# Altium project Common_HVSUP_ISOL_6W.PrjPCB (part 2 of 5)

## Sheet HV_PWR_STAGE_6W.SchDoc: HV_Module
size 420 x 297 mm; EDA_Number: ARTIQ; Projet: HV_Module; Author: G.Kasprowicz; CompanyName: WUT ISE; DrawnBy: G.Kasprowicz; Organization: WUT ISE; Address1: PW ISE; Address2: Nowowiejska 15/19 00-665 Warsaw; Address3: gkasprow@gmail.com; DocumentNumber: 3; Revision: 1.0; SheetNumber: 3; SheetTotal: 6; ModifiedBy: -; CheckedDate: -; Title2: HV_PWR_Stage; DivGrp: WUT ISE; Designer: G.Kasprowicz; ModifiedDate: -; ProjectName: Sensor Box
Used 2 times, as channels U_HV_Module/U_HV_PWR_STAGE1, U_HV_Module/U_HV_PWR_STAGE2. Parts and nets are listed once, with the designators drawn on the sheet.
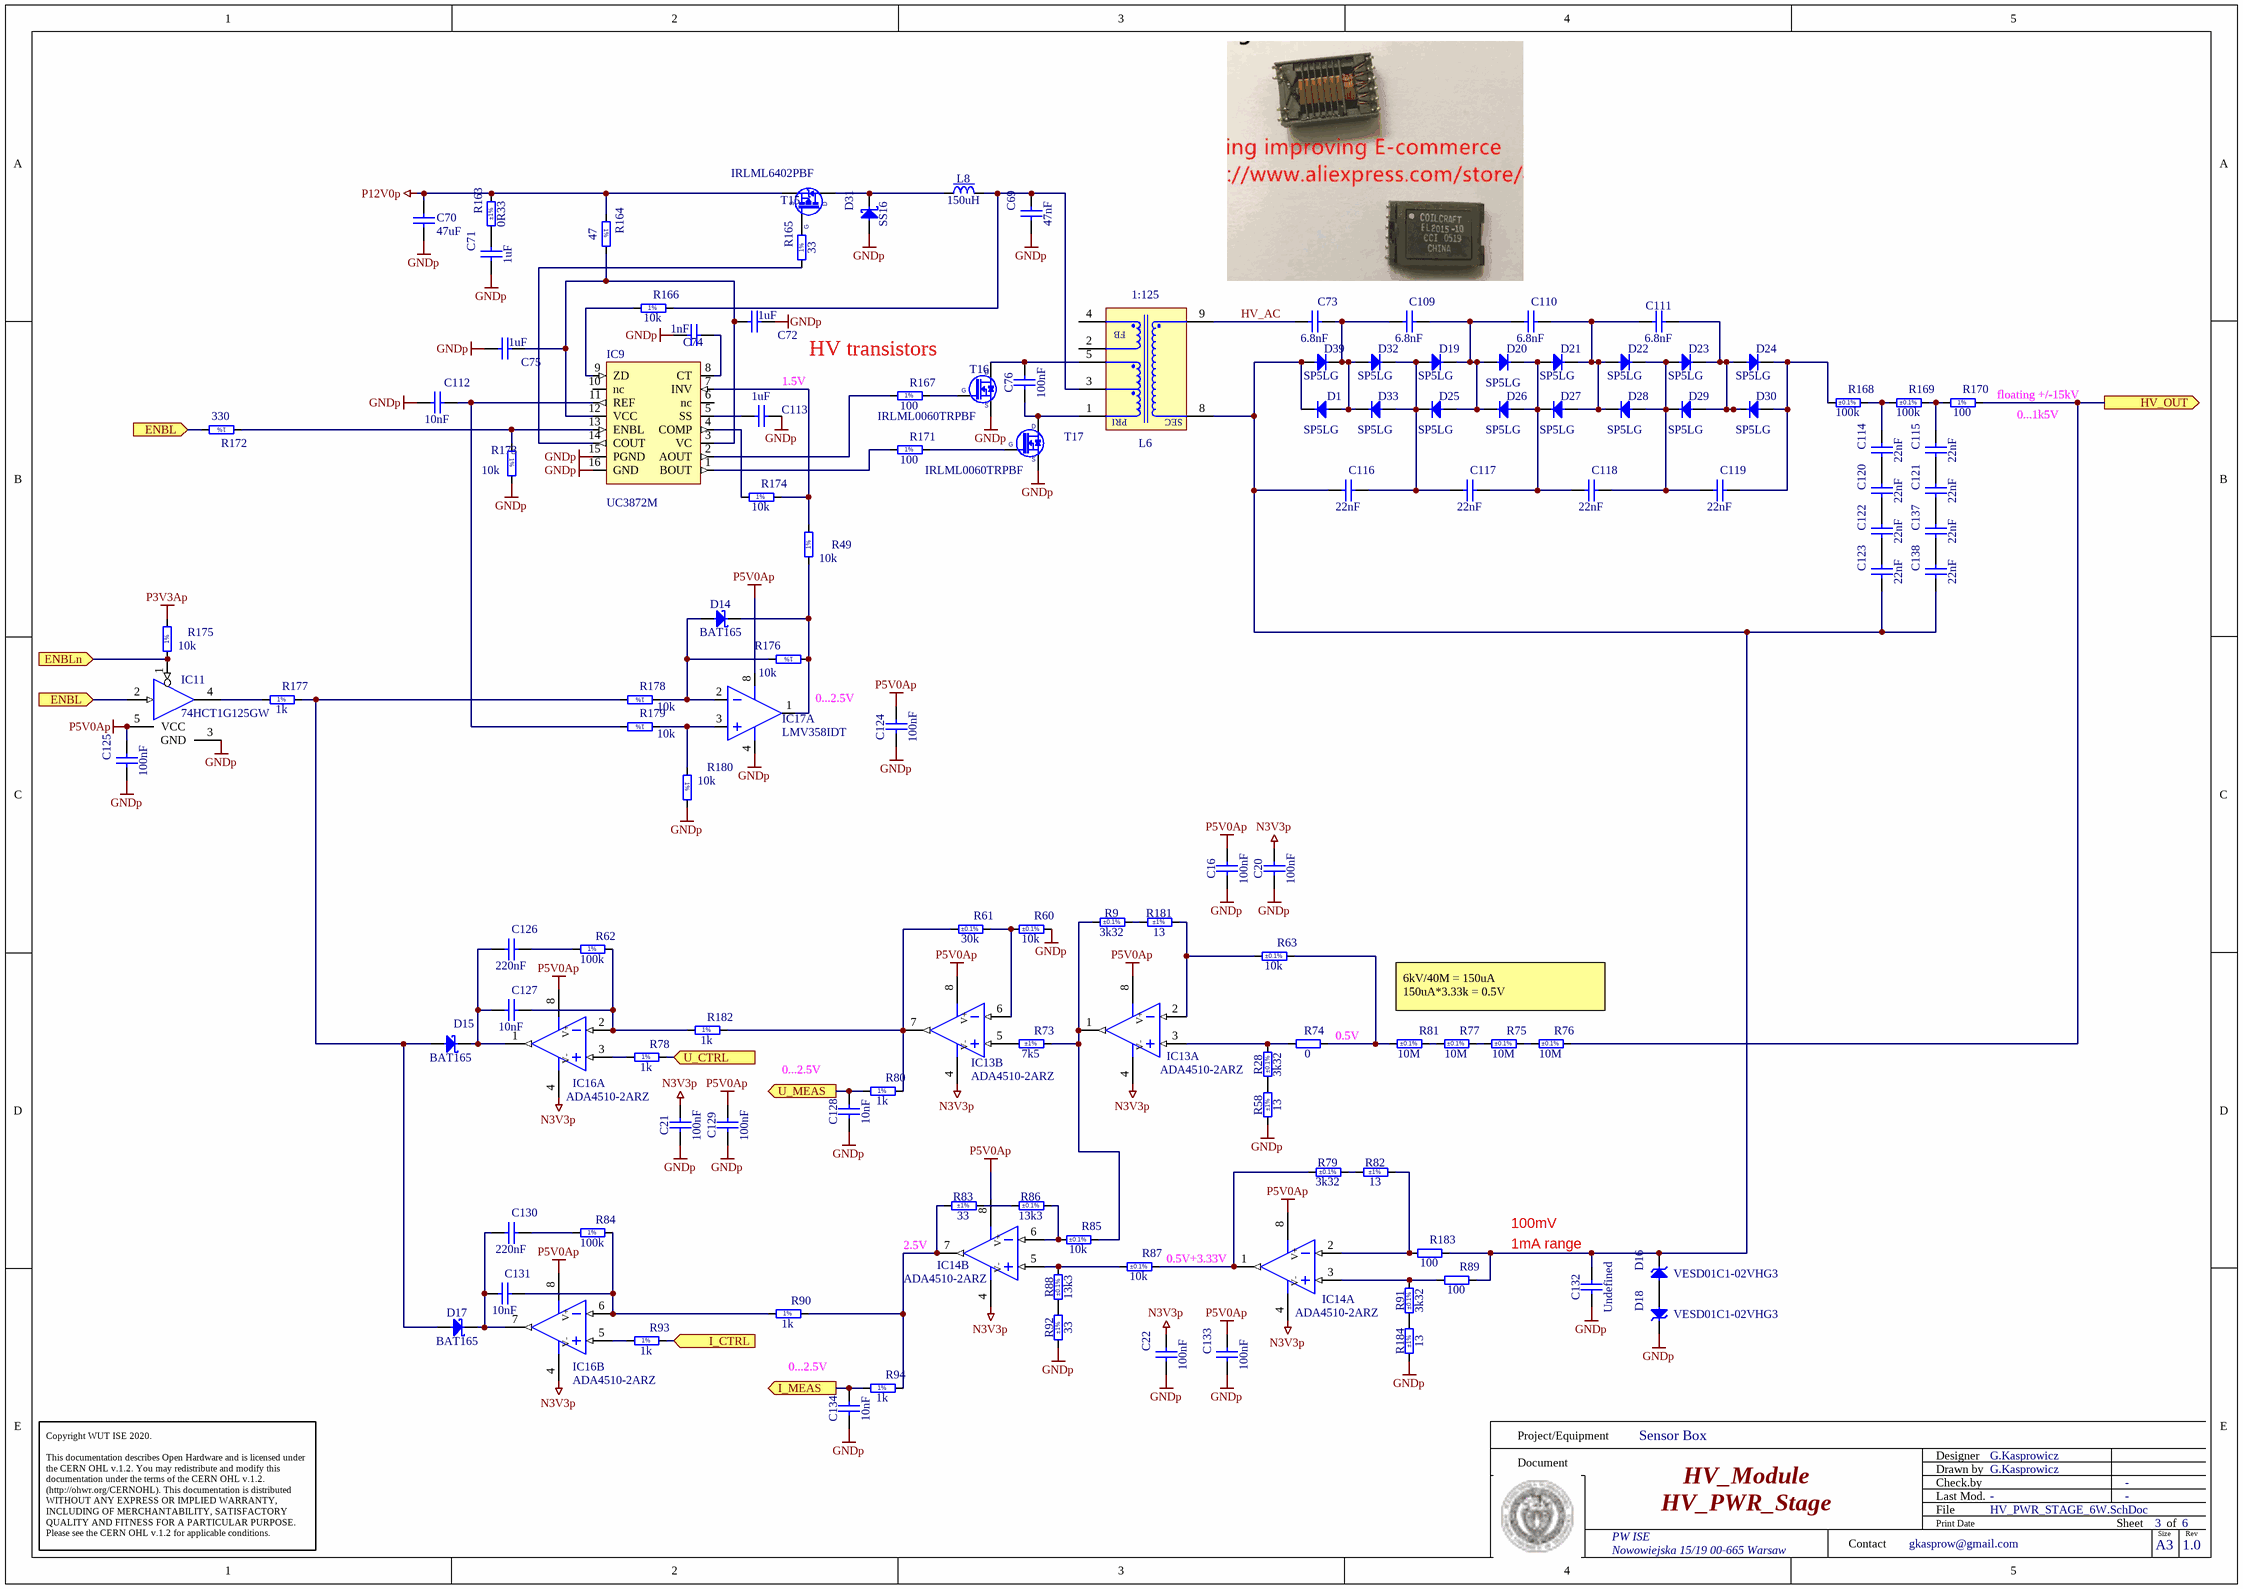
[diagram p4: HV_PWR_STAGE_6W.SchDoc]

### Parts
C16  100nF  [CAPC1005X55N]
C20  100nF  [CAPC1005X55N]
C21  100nF  [CAPC1005X55N]
C22  100nF  [CAPC1005X55N]
C69  47nF  [CAPR500-250X720X650]
C70  47uF  [CAPC3216X180N]
C71  1uF  [CAPC1608X87N]
C72  1uF  [CAPC1608X87N]
C73  6.8nF  [CAPC3225X170N]
C74  1nF  [CAPC1005X55N]
C75  1uF  [CAPC1608X87N]
C76  100nF  [CAPR500-250X720X650]
C109  6.8nF  [CAPC3225X170N]
C110  6.8nF  [CAPC3225X170N]
C111  6.8nF  [CAPC3225X170N]
C112  10nF  [CAPC1608X87N]
C113  1uF  [CAPC1608X87N]
C114  22nF  [CAPC5750X330N]
C115  22nF  [CAPC5750X330N]
C116  22nF  [CAPC5750X330N]
C117  22nF  [CAPC5750X330N]
C118  22nF  [CAPC5750X330N]
C119  22nF  [CAPC5750X330N]
C120  22nF  [CAPC5750X330N]
C121  22nF  [CAPC5750X330N]
C122  22nF  [CAPC5750X330N]
C123  22nF  [CAPC5750X330N]
C124  100nF  [CAPC1005X55N]
C125  100nF  [CAPC1005X55N]
C126  220nF  [CAPC1608X87N]
C127  10nF  [CAPC1608X87N]
C128  10nF  [CAPC1005X55N]
C129  100nF  [CAPC1005X55N]
C130  220nF  [CAPC1608X87N]
C131  10nF  [CAPC1608X87N]
C132  Undefined  [CAPC1608X90N]
C133  100nF  [CAPC1005X55N]
C134  10nF  [CAPC1005X55N]
C137  22nF  [CAPC5750X330N]
C138  22nF  [CAPC5750X330N]
D1  SP5LG  [DO-214AC_GW]
D14  BAT165  [SOD2512X110N]
D15  BAT165  [SOD2512X110N]
D16  VESD01C1-02VHG3  [SODFL1608X70N]
D17  BAT165  [SOD2512X110N]
D18  VESD01C1-02VHG3  [SODFL1608X70N]
D19  SP5LG  [DO-214AC_GW]
D20  SP5LG  [DO-214AC_GW]
D21  SP5LG  [DO-214AC_GW]
D22  SP5LG  [DO-214AC_GW]
D23  SP5LG  [DO-214AC_GW]
D24  SP5LG  [DO-214AC_GW]
D25  SP5LG  [DO-214AC_GW]
D26  SP5LG  [DO-214AC_GW]
D27  SP5LG  [DO-214AC_GW]
D28  SP5LG  [DO-214AC_GW]
D29  SP5LG  [DO-214AC_GW]
D30  SP5LG  [DO-214AC_GW]
D31  SS16  [DIOM5127X229N]
D32  SP5LG  [DO-214AC_GW]
D33  SP5LG  [DO-214AC_GW]
D39  SP5LG  [DO-214AC_GW]
IC9  UC3872M  [R-PDSO-G16]
IC11  74HCT1G125GW  [SOT65P210X110-5N]
IC13  ADA4510-2ARZ  [SOIC127P600X175-8N]  (parts A,B of 2)
IC14  ADA4510-2ARZ  [SOIC127P600X175-8N]  (parts A,B of 2)
IC16  ADA4510-2ARZ  [SOIC127P600X175-8N]  (parts A,B of 2)
IC17  LMV358IDT  [SO-8]  (part A of 2)
L6  1:125  [XFMR_COILCRAFT_FL0215_PACK1]
L8  150uH  [IND_WURTH_WE-TPC_1038]
R9  3k32  Tolerance: ±0.1%  [RESC1608X55N]
R28  3k32  Tolerance: ±0.1%  [RESC1608X55N]
R49  10k  [RESC1005X40N]
R58  13  Tolerance: ±1%  [RESC1005X40N]
R60  10k  Tolerance: ±0.1%  [RESC1608X55N]
R61  30k  Tolerance: ±0.1%  [RESC1608X55N]
R62  100k  [RESC1608X55N]
R63  10k  Tolerance: ±0.1%  [RESC1608X55N]
R73  7k5  Tolerance: ±1%  [RESC1608X55N]
R74  0  [RESC1005X40N]
R75  10M  Tolerance: ±0.1%  [RESC5025X65N]
R76  10M  Tolerance: ±0.1%  [RESC5025X65N]
R77  10M  Tolerance: ±0.1%  [RESC5025X65N]
R78  1k  [RESC1005X40N]
R79  3k32  Tolerance: ±0.1%  [RESC1608X55N]
R80  1k  [RESC1005X40N]
R81  10M  Tolerance: ±0.1%  [RESC5025X65N]
R82  13  Tolerance: ±1%  [RESC1005X40N]
R83  33  Tolerance: ±1%  [RESC1005X40N]
R84  100k  [RESC1608X55N]
R85  10k  Tolerance: ±0.1%  [RESC1608X55N]
R86  13k3  Tolerance: ±0.1%  [RESC1608X55N]
R87  10k  Tolerance: ±0.1%  [RESC1608X55N]
R88  13k3  Tolerance: ±0.1%  [RESC1608X55N]
R89  100  [RESC1005X40N]
R90  1k  [RESC1005X40N]
R91  3k32  Tolerance: ±0.1%  [RESC1608X55N]
R92  33  Tolerance: ±1%  [RESC1005X40N]
R93  1k  [RESC1005X40N]
R94  1k  [RESC1005X40N]
R163  0R33  Tolerance: ±1%  [RESC1608X60N]
R164  47  [RESC1608X55N]
R165  33  [RESC1005X40N]
R166  10k  [RESC1005X40N]
R167  100  [RESC1005X40N]
R168  100k  Tolerance: ±0.1%  [RESC3216X50N]
R169  100k  Tolerance: ±0.1%  [RESC3216X50N]
R170  100  [RESC6331X70N]
R171  100  [RESC1005X40N]
R172  330  [RESC1005X40N]
R173  10k  [RESC1005X40N]
R174  10k  [RESC1005X40N]
R175  10k  [RESC1005X40N]
R176  10k  [RESC1005X40N]
R177  1k  [RESC1005X40N]
R178  10k  [RESC1005X40N]
R179  10k  [RESC1005X40N]
R180  10k  [RESC1005X40N]
R181  13  Tolerance: ±1%  [RESC1005X40N]
R182  1k  [RESC1005X40N]
R183  100  [RESC1005X40N]
R184  13  Tolerance: ±1%  [RESC1005X40N]
T15  IRLML6402PBF  [SOT95P237X112-3N]
T16  IRLML0060TRPBF  [SOT95P237X112-3N]
T17  IRLML0060TRPBF  [SOT95P237X112-3N]

### Ports
ENBL (in), ENBLn (in), HV_OUT (out), I_CTRL (in), I_MEAS (out), U_CTRL (in), U_MEAS (out)

### Nets
GNDp: C16.1 C20.1 C21.1 C22.1 C69.1 C70.2 C71.1 C72.1 C74.2 C75.2 C112.1 C113.1 C124.1 C125.1 C128.1 C129.1 C132.1 C133.1 C134.1 D18.1(C) D31.2(A) IC9.15(PGND) IC9.16(GND) IC11.3(GND) IC17.4(V-) R58.1 R60.2 R92.1 R173.2 R180.2 R184.1 T16.2(S) T17.2(S)
N3V3p: C20.2 C21.2 C22.2 IC13.4(V-) IC14.4(V-) IC16.4(V-)
P3V3Ap: R175.2
P5V0Ap: C16.2 C124.2 C125.2 C129.2 C133.2 IC11.5(VCC) IC13.8(V+) IC14.8(V+) IC16.8(V+) IC17.8(V+)
P12V0p: C70.1 R163.2 R164.1 T15.2(S)
ENBL: IC11.2(IN) R172.2 ; port ENBL
ENBLn: IC11.1(~{G}) R175.1 ; port ENBLn
HV_AC: C73.1 L6.9
HV_OUT: R76.2 R170.2 ; port HV_OUT
I_CTRL: R93.2 ; port I_CTRL
I_MEAS: C134.2 R94.1 ; port I_MEAS
U_CTRL: R78.2 ; port U_CTRL
U_MEAS: C128.2 R80.1 ; port U_MEAS
NetC69_2: C69.2 L6.3 L8.2 R166.2
NetC71_2: C71.2 R163.1
NetC72_2: C72.2 C75.1 IC9.3(VC) IC9.12(VCC) R164.2
NetC73_2: C73.2 C109.1 D1.2(A) D32.2(A) D33.1(C) D39.1(C)
NetC74_1: C74.1 IC9.8(CT)
NetC76_1: C76.1 L6.1 T17.3(D)
NetC76_2: C76.2 L6.5 T16.3(D)
NetC109_2: C109.2 C110.1 D19.1(C) D20.2(A) D25.2(A) D26.1(C)
NetC110_2: C110.2 C111.1 D21.1(C) D22.2(A) D27.2(A) D28.1(C)
NetC111_2: C111.2 D23.1(C) D24.2(A) D29.2(A) D30.1(C)
NetC112_2: C112.2 IC9.11(REF) R179.2
NetC113_2: C113.2 IC9.5(SS)
NetC114_1: C114.1 C120.2
NetC114_2: C114.2 R168.2 R169.1
NetC115_1: C115.1 C121.2
NetC115_2: C115.2 R169.2 R170.1
NetC116_1: C116.1 C123.1 C132.2 C138.1 D1.1(C) D16.1(C) D39.2(A) L6.8 R89.2 R183.2
NetC116_2: C116.2 C117.1 D19.2(A) D25.1(C) D32.1(C) D33.2(A)
NetC117_2: C117.2 C118.1 D20.1(C) D21.2(A) D26.2(A) D27.1(C)
NetC118_2: C118.2 C119.1 D22.1(C) D23.2(A) D28.2(A) D29.1(C)
NetC119_2: C119.2 D24.1(C) D30.2(A) R168.1
NetC120_1: C120.1 C122.2
NetC121_1: C121.1 C137.2
NetC122_1: C122.1 C123.2
NetC126_1: C126.1 C127.1 D15.1(C) IC16.1(OUT)
NetC126_2: C126.2 R62.1
NetC127_2: C127.2 IC16.2(IN-) R62.2 R182.1
NetC130_1: C130.1 C131.1 D17.1(C) IC16.7(OUT)
NetC130_2: C130.2 R84.1
NetC131_2: C131.2 IC16.6(IN-) R84.2 R90.1
NetC137_1: C137.1 C138.2
NetD14_1: D14.1(C) IC17.1(OUT) R49.1 R176.1
NetD14_2: D14.2(A) IC17.2(IN-) R176.2 R178.1
NetD15_2: D15.2(A) D17.2(A) R177.2 R178.2
NetD16_2: D16.2(A) D18.2(A)
NetD31_1: D31.1(C) L8.1 T15.3(D)
NetIC9_1: IC9.1(BOUT) R171.1
NetIC9_2: IC9.2(AOUT) R167.1
NetIC9_4: IC9.4(COMP) R174.1
NetIC9_7: IC9.7(INV) R49.2 R174.2
NetIC9_9: IC9.9(ZD) R166.1
NetIC9_13: IC9.13(ENBL) R172.1 R173.1
NetIC9_14: IC9.14(COUT) R165.1
NetIC11_4: IC11.4(OUT) R177.1
NetIC13_1: IC13.1(OUT) R9.1 R73.2 R85.2
NetIC13_2: IC13.2(IN-) R63.1 R181.2
NetIC13_3: IC13.3(IN+) R28.2 R74.1
NetIC13_5: IC13.5(IN+) R73.1
NetIC13_6: IC13.6(IN-) R60.1 R61.2
NetIC13_7: IC13.7(OUT) R61.1 R80.2 R182.2
NetIC14_1: IC14.1(OUT) R79.1 R87.2
NetIC14_2: IC14.2(IN-) R82.2 R183.1
NetIC14_3: IC14.3(IN+) R89.1 R91.2
NetIC14_5: IC14.5(IN+) R87.1 R88.2
NetIC14_6: IC14.6(IN-) R85.1 R86.2
NetIC14_7: IC14.7(OUT) R83.1 R90.2 R94.2
NetIC16_3: IC16.3(IN+) R78.1
NetIC16_5: IC16.5(IN+) R93.1
NetIC17_3: IC17.3(IN+) R179.1 R180.1
NetR9_2: R9.2 R181.1
NetR28_1: R28.1 R58.2
NetR63_2: R63.2 R74.2 R81.1
NetR75_1: R75.1 R77.2
NetR75_2: R75.2 R76.1
NetR77_1: R77.1 R81.2
NetR79_2: R79.2 R82.1
NetR83_2: R83.2 R86.1
NetR88_1: R88.1 R92.2
NetR91_1: R91.1 R184.2
NetR165_2: R165.2 T15.1(G)
NetR167_2: R167.2 T16.1(G)
NetR171_2: R171.2 T17.1(G)

Not connected (* = marked no-connect by the designer): IC9 6(nc) 10(nc); L6 2 4

### Channels
U_HV_Module/U_HV_PWR_STAGE1: designators end in A; ports ENBL=NetIC11A_2 ENBLn=ENBLn1 HV_OUT=NetJ7_1 I_CTRL=NetIC15A_23 I_MEAS=NetC134A_2 U_CTRL=NetIC15A_24 U_MEAS=U_meas1
U_HV_Module/U_HV_PWR_STAGE2: designators end in B; ports ENBL=NetIC11A_2 ENBLn=ENBLn2 HV_OUT=NetJ4_1 I_CTRL=NetIC15B_23 I_MEAS=NetC134B_2 U_CTRL=NetIC15B_24 U_MEAS=U_meas2

### Notes on the sheet
- (near C113) 1.5V
- (near T16) HV transistors
- (near R170) floating +/-15kV
- (near R170) 0...1k5V
- 0...2.5V
- (near R74) 0.5V
- 6kV/40M = 150uA
  150uA*3.33k = 0.5V
- 2.5V
- (near R87) 0.5V+3.33V
- 1mA range
- 100mV
- Project/Equipment
- Document
- Designer
- Drawn by
- Check.by
- Copyright WUT ISE 2020.
  This documentation describes Open Hardware and is licensed under the CERN OHL v.1.2. You may redistribute and modify this documentation under the terms of the CERN OHL v.1.2. (http://ohwr.org/CERNOHL). This documentation is distributed WITHOUT ANY EXPRESS OR IMPLIED WARRANTY, INCLUDING OF MERCHANTABILITY, SATISFACTORY QUALITY AND FITNESS FOR A PARTICULAR PURPOSE. Please see the CERN OHL v.1.2 for applicable conditions.
- Contact
- File
- Last Mod.
- Print Date
- Sheet
- Size
- A3
- of
- Rev
- (in symbol R0402_1K_1%_0.0625W_100PPM) 1%
- (in symbol R0402_10K_1%_0.0625W_100PPM) 1%
- (in symbol R0402_33R_1%_0.0625W_100PPM) 1%
- (in symbol R0402_100R_1%_0.0625W_100PPM) 1%
- (in symbol R0402_330R_1%_0.0625W_100PPM) 1%
- (in symbol R0603_47R_1%_0.1W_100PPM) 1%
- (in symbol R0603_100K_1%_0.1W_100PPM) 1%
- (in symbol R2512_100R_1%_1.5W_100PPM_VISHAY_CRCW-HP e3) 1%
- (in symbol XFMR_COILCRAFT_FL2015-5L) FB; PRI; SEC

### Library data of the parts
C16 C20-C22 C124 C125 C129 C133 = CC0402_100NF_16V_10%_X7R: Non-polarised capacitor; Part Description: SMD Multilayer Chip Ceramic Capacitor; Manufacturer: GENERIC; Manufacturer1 Part Number: GRM155R71C104KA88D; Voltage: 16V; TC: X7R; Tolerance: ±10%; Part Number: CC0402_100NF_16V_10%_X7R; Component Kind: Standard; Component Type: Standard; Pin Count: 2; Value: 100nF; Status: Not Recommended; Manufacturer Part Number: CC0402_100NF_16V_10%_X7R; Case: 0402; Mounted: Yes; Socket: No; SMD: Yes; Sense: No; Manufacturer1 Example: MURATA; Manufacturer1 ComponentHeight: 0.55mm; HelpURL: \\cern.ch\dfs\Applications\Altium\Datasheets\CC0402_X7R_MURATA_GRM.pdf; Author: CERN DEM JLC
  C16 C20-C22 C124 C133: CreateDate: 2013-12-05; LatestRevisionDate: 2007-12-03
  C125 C129: CreateDate: 05.12.2013; LatestRevisionDate: 03.12.2007
C69 = CPER_47NF_63V_10%_500-250X720X650: Non-polarised capacitor; Part Description: Metallized Polyester Film Capacitor (MKT); Manufacturer: TDK; Manufacturer Part Number: B32529C0473K000; Voltage: 63VDC/40VAC; Tolerance: ±10%; Part Number: CPER_47NF_63V_10%_500-250X720X650; Component Kind: Standard; Component Type: Standard; Pin Count: 2; Value: 47nF; Status: None; Case: LS5 W2.5 x L7.2 x H6.5; Mounted: Yes; Socket: No; SMD: No; Sense: No; ComponentHeight: 6.5mm; HelpURL: \\cern.ch\dfs\Applications\Altium\Datasheets\CPER_TDK_B32529.pdf; Author: CERN DEM JLC; CreateDate: 2007-12-19; LatestRevisionDate: 2015-04-22
C70 = CC1206_47UF_25V_20%_X5R: Non-polarised capacitor; Part Description: SMD Multilayer Chip Ceramic Capacitor; Manufacturer: TDK; Manufacturer Part Number: C3216X5R1E476M160AC; Voltage: 25V; TC: X5R; Tolerance: ±20%; Table: Capacitors SMD; Part Number: CC1206_47UF_25V_20%_X5R; Component Kind: Standard; Component Type: Standard; Pin Count: 2; Value: 47uF; Status: None; Case: 1206; Mounted: Yes; Socket: No; SMD: Yes; HelpURL: \\cern.ch\dfs\Applications\Altium\Datasheets\CC1206_X5R_TDK_C.pdf; Author: CERN DEM JLC; CreateDate: 2013-11-20; LatestRevisionDate: 2013-11-20; ComponentHeight: 1.8mm
C71 C72 C75 C113 = CC0603_1UF_25V_10%_X7R: Non-polarised capacitor; Part Description: SMD Multilayer Chip Ceramic Capacitor; Manufacturer: GENERIC; Manufacturer1 Part Number: GRM188R71E105KA12D; Voltage: 25V; TC: X7R; Tolerance: ±10%; Part Number: CC0603_1UF_25V_10%_X7R; Component Kind: Standard; Component Type: Standard; Pin Count: 2; Value: 1uF; Status: None; Manufacturer Part Number: CC0603_1UF_25V_10%_X7R; Case: 0603; Mounted: Yes; Socket: No; SMD: Yes; Sense: No; Manufacturer1 Example: MURATA; Manufacturer1 ComponentHeight: 0.9mm; HelpURL: \\cern.ch\dfs\Applications\Altium\Datasheets\CC0603_X7R_MURATA.pdf; Author: CERN DEM JLC; CreateDate: 2011-01-18; LatestRevisionDate: 2011-01-18
C73 C109-C111 = CC1210_6.8NF_2KV_10%_X7R: Non-polarised capacitor; Part Description: High Voltage MLC Chip Capacitor; Manufacturer: GENERIC; Manufacturer1 Part Number: C1210C682KGRACTU; Voltage: 2kV; TC: X7R; Tolerance: ±10%; Part Number: CC1210_6.8NF_2KV_10%_X7R; Component Kind: Standard; Component Type: Standard; Pin Count: 2; Value: 6.8nF; Status: None; Manufacturer Part Number: CC1210_6.8NF_2KV_10%_X7R; Case: 1210; Mounted: Yes; Socket: No; SMD: Yes; Sense: No; Manufacturer1 Example: KEMET; Manufacturer1 ComponentHeight: 1.7mm; HelpURL: \\cern.ch\dfs\Applications\Altium\Datasheets\CC1206_X7R_AVX_HV-MLC.pdf; Author: GK; CreateDate: 03.02.2016; LatestRevisionDate: 03.02.2016
C74 = CC0402_1NF_50V_10%_X7R: Non-polarised capacitor; Part Description: SMD Multilayer Chip Ceramic Capacitor; Manufacturer: GENERIC; Manufacturer1 Part Number: 223858715623; Voltage: 50V; TC: X7R; Tolerance: ±10%; Part Number: CC0402_1NF_50V_10%_X7R; Component Kind: Standard; Component Type: Standard; Pin Count: 2; Value: 1nF; Status: Not Recommended; Manufacturer Part Number: CC0402_1NF_50V_10%_X7R; Case: 0402; Mounted: Yes; Socket: No; SMD: Yes; Sense: No; Manufacturer1 Example: PHYCOMP; Manufacturer1 ComponentHeight: 0.55mm; HelpURL: \\cern.ch\dfs\Applications\Altium\Datasheets\CC0402_X7R_PHYCOMP.pdf; Author: CERN DEM JLC; CreateDate: 2007-12-03; LatestRevisionDate: 2007-12-03
C76 = CPER_100NF_100V_10%_500-250X720X650: Non-polarised capacitor; Part Description: Metallized Polyester Film Capacitor (MKT); Manufacturer: TDK; Manufacturer Part Number: B32529C1104K000; Voltage: 100VDC/63VAC; Tolerance: ±10%; Part Number: CPER_100NF_100V_10%_500-250X720X650; Component Kind: Standard; Component Type: Standard; Pin Count: 2; Value: 100nF; Status: None; Case: LS5 W2.5 x L7.2 x H6.5; Mounted: Yes; Socket: No; SMD: No; Sense: No; ComponentHeight: 6.5mm; HelpURL: \\cern.ch\dfs\Applications\Altium\Datasheets\CPER_TDK_B32529.pdf; Author: CERN DEM JLC; CreateDate: 2010-03-22; LatestRevisionDate: 2015-04-22
C112 C127 C131 = CC0603_10NF_50V_5%_C0G: Non-polarised capacitor; Part Description: SMD Multilayer Chip Ceramic Capacitor; Manufacturer: GENERIC; Manufacturer1 Part Number: C1608C0G1H103J080AA; Voltage: 50V; TC: C0G/NP0; Tolerance: ±5%; Part Number: CC0603_10NF_50V_5%_C0G; Component Kind: Standard; Component Type: Standard; Pin Count: 2; Value: 10nF; Status: Preferred; Manufacturer Part Number: CC0603_10NF_50V_5%_C0G; Case: 0603; Mounted: Yes; Socket: No; SMD: Yes; Sense: No; Manufacturer1 Example: TDK; Manufacturer1 ComponentHeight: 0.9mm; HelpURL: \\cern.ch\dfs\Applications\Altium\Datasheets\CC0603_C0G_TDK_C.pdf; Author: CERN DEM JLC; CreateDate: 2014-12-10; LatestRevisionDate: 2014-12-10
C114-C123 C137 C138 = CC2220_22NF_2KV_10%_X7R: Non-polarised capacitor; Part Description: High Voltage SMD Multilayer Chip Ceramic Capacitor FLEXITERM; Manufacturer: KEMET; Manufacturer Part Number: C2220C223KGRACAUTO; Voltage: 2KV; TC: X7R; Tolerance: ±10%; Part Number: CC2220_22NF_2KV_10%_X7R; Component Kind: Standard; Component Type: Standard; Pin Count: 2; Value: 22nF; Status: None; Case: 2220; Mounted: Yes; Socket: No; SMD: Yes; Sense: No; HelpURL: \\cern.ch\dfs\Applications\Altium\Datasheets\CC2220_X7R_AVX_FLEXITERM.pdf; Author: GK; CreateDate: 05.03.2015; LatestRevisionDate: 10.04.2017; ComponentHeight: 3.4mm
C126 C130 = CC0603_220NF_10V_10%_X7R: Non-polarised capacitor; Part Description: SMD Multilayer Chip Ceramic Capacitor; Manufacturer: GENERIC; Manufacturer1 Part Number: 223824615654 or CC0603KRX7R6BB224; Voltage: 10V; TC: X7R; Tolerance: ±10%; Part Number: CC0603_220NF_10V_10%_X7R; Component Kind: Standard; Component Type: Standard; Pin Count: 2; Value: 220nF; Status: Preferred; Manufacturer Part Number: CC0603_220NF_10V_10%_X7R; Case: 0603; Mounted: Yes; Socket: No; SMD: Yes; Sense: No; Manufacturer1 Example: YAGEO PHYCOMP; Manufacturer1 ComponentHeight: 0.9mm; HelpURL: \\cern.ch\dfs\Applications\Altium\Datasheets\CC0603_X7R_PHYCOMP.pdf; Author: CERN DEM JLC; CreateDate: 2012-10-25; LatestRevisionDate: 2012-10-25
C128 C134 = CC0402_10NF_25V_10%_X7R: Non-polarised capacitor; Part Description: SMD Multilayer Chip Ceramic Capacitor; Manufacturer: GENERIC; Manufacturer1 Part Number: C1005X7R1E103K050; Voltage: 25V; TC: X7R; Tolerance: ±10%; Part Number: CC0402_10NF_25V_10%_X7R; Component Kind: Standard; Component Type: Standard; Pin Count: 2; Value: 10nF; Status: Preferred; Manufacturer Part Number: CC0402_10NF_25V_10%_X7R; Case: 0402; Mounted: Yes; Socket: No; SMD: Yes; Sense: No; Manufacturer1 Example: TDK; Manufacturer1 ComponentHeight: 0.55mm; HelpURL: \\cern.ch\dfs\Applications\Altium\Datasheets\CC0402_X7R_TDK_C.pdf; Author: CERN DEM JLC; CreateDate: 25.10.2012; LatestRevisionDate: 25.10.2012
C132 = CC0603_NO-VALUE: Non-polarised capacitor; Part Description: Reserved Footprint For 0603(1608) Chip Ceramic Capacitor; Mounted: No; Part Number: CC0603_NO-VALUE; Component Kind: Standard; Component Type: Standard; Pin Count: 2; Value: Undefined; Status: None; Manufacturer: Undefined; Manufacturer Part Number: CC0603_NO-VALUE; Case: 0603; Socket: No; SMD: Yes; Sense: No; Manufacturer1 ComponentHeight: 0.9mm; HelpURL: Undefined; Author: CERN DEM MR; CreateDate: 22.11.2016; LatestRevisionDate: 22.11.2016
D1 D19-D30 D32 D33 D39 = D_SP5LG: 270mA High Voltage Fast Recovery Rectifier 5000 Volts; Part Description: 270mA High Voltage Fast Recovery Rectifier 4000 Volts; Manufacturer: DEAN/GETE; Voltage: 5000V; PressFit: No; Bonding: No; Part Number: SP5LG; Component Kind: Standard; Component Type: Standard; Device: SP5LG; PackageDescription: DO-214-AC/SMA Diode, Molded Body; 5.10mm L X 2.67mm W X 2.29mm H, IPC Medium Density; Power: 270mA; Manufacturer Part Number: SP5LG; Pin Count: 2; Case: DO-214AC; Mounted: Yes; Socket: No; SMD: Yes; Sense: No; ComponentHeight: 2.29mm; HelpURL: \\cern.ch\dfs\Applications\Altium\Datasheets\BYG23T-M3.pdf; Author: GK; CreateDate: 18.11.2015; LatestRevisionDate: 29.06.2022
D14 D15 D17 = BAT165: Schottky Diode; Part Description: Medium Power AF Schottky Diode; Manufacturer: INFINEON; Voltage: 40V; Power: 750mA; PressFit: No; Bonding: No; Part Number: BAT165; Component Kind: Standard; Component Type: Standard; Device: BAT165; Manufacturer Part Number: BAT165; Pin Count: 2; Mounted: Yes; Socket: No; SMD: Yes; Sense: No; ComponentHeight: 1.1mm; HelpURL: \\cern.ch\dfs\Applications\Altium\Datasheets\BAT165.pdf; Author: CERN DEM JLC
  D14: PackageDescription: Small Outline Diode Flat Lead (SOD-323), 1.70mm W X 1.25mm L X 1.10mm H body,  IPC Medium Density; Case: SOD323; CreateDate: 2014-11-12; LatestRevisionDate: 2014-11-12
  D15 D17: PackageDescription: Small Outline Diode (SOD-323), 1.70mm W X 1.25mm L X 1.10mm H body,  IPC Medium Density; Case: SOD-323; CreateDate: 12.11.2014; LatestRevisionDate: 12.11.2014
D16 D18 = VESD01C1-02VHG3: Transient Voltage Suppressor Diode (Uni-Directional); Part Description: Single-Line ESD-Protection (30kV) Diode; Manufacturer: VISHAY SEMICONDUCTORS; Voltage: 1V; Power: 100W; PressFit: No; Bonding: No; Part Number: VESD01C1-02VHG3; Component Kind: Standard; Component Type: Standard; Device: VESD01C1-02VHG3; PackageDescription: SODFL (SOD-523) Diode; 1.20mm W X 0.80mm L X 0.70mm H body, IPC Medium Density; Manufacturer Part Number: VESD01C1-02VHG3; Pin Count: 2; Case: SOD-523; Mounted: Yes; Socket: No; SMD: Yes; Sense: No; ComponentHeight: 0.7mm; HelpURL: \\cern.ch\dfs\Applications\Altium\Datasheets\VESD01C1-02VHG3.pdf; Author: CERN DEM BC; CreateDate: 19.05.2020; LatestRevisionDate: 19.05.2020
D31 = SS16: Schottky Diode; Part Description: Surface Mount Schottky Barrier Rectifier; Manufacturer: VISHAY GENERAL SEMICONDUCTOR; Voltage: 60V; Power: 1A; PressFit: No; Bonding: No; Part Number: SS16; Component Kind: Standard; Component Type: Standard; Device: SS16; PackageDescription: DO-214-AC Molded Diode, Body 5.1x2.7mm, IPC Medium Density; Manufacturer Part Number: SS16; Pin Count: 2; Case: DO-214AC; Mounted: Yes; Socket: No; SMD: Yes; Sense: No; ComponentHeight: 2.29mm; HelpURL: \\cern.ch\dfs\Applications\Altium\Datasheets\SS16.pdf; Author: CERN DEM JLC; CreateDate: 2008-07-15; LatestRevisionDate: 2010-08-23
IC9 = UC3872: Resonant Lamp Ballast Controller
IC11 = 74HCT1G125GW: Single Bus Buffer Gate With 3-State Output; Part Description: Bus Buffer/Line Driver 3-State; Manufacturer: NEXPERIA; PressFit: No; Bonding: No; Part Number: 74HCT1G125GW; Component Kind: Standard; Component Type: Standard; Device: 74HCT1G125GW; PackageDescription: SOT353, SC70-5, 0.65mm Pitch; 5 Pin, 1.25mm W X 2.00mm L X 1.10mm H body, IPC Medium Density; Manufacturer Part Number: 74HCT1G125GW; Pin Count: 5; Case: SOT353; Mounted: Yes; Socket: No; SMD: Yes; Sense: No; ComponentHeight: 1.1mm; Author: CERN DEM JMW; HelpURL: \\cern.ch\dfs\Applications\Altium\Datasheets\74HCT1G125GW.pdf; CreateDate: 06.08.2020; LatestRevisionDate: 06.08.2020
IC13 IC14 IC16 = OA_ADA4510-2ARZ: Precision, 40 V, ±70 nV/°C, Rail-to-Rail Input and Output Op Amp with DigiTrim; Manufacturer: ANALOG DEVICES; Part Description: 40V, EMI Enhanced, Zero Drift, Ultralow Noise, Dual Rail-to-Rail Output Operational Amplifier; PressFit: No; Bonding: No; PackageDescription: SOIC 8, Pitch 1.27mm - Body 4x5mm, IPC Medium Density; Part Number: ADA4510-2ARZ; Component Kind: Standard; Component Type: Standard; Device: ADA4510-2ARZ; Manufacturer Part Number: ADA4510-2ARZ; Pin Count: 8; Case: SOIC8; Mounted: Yes; Socket: No; SMD: Yes; Sense: No; ComponentHeight: 1.75mm; Author: GK; HelpURL: \\cern.ch\dfs\Applications\Altium\Datasheets\ADA4522-X.pdf; CreateDate: 05.01.2023; LatestRevisionDate: 05.01.2023
IC17 = OA_LMV358: Low voltage, Rail-to_Rail output Operational Amplifier
L6 = XFMR_COILCRAFT_FL2015-5L: Shielded Power Inductor; Part Description: Transformers for Royer and Flyback Topologies FL Series; Part Number: XFMR_COILCRAFT_FL2015-5L; Component Kind: Standard; Component Type: Standard; Pin Count: 10; Value: 1:125; Status: None; Manufacturer: COILCRAFT; Manufacturer Part Number: FL2015-5L; Mounted: Yes; Socket: No; Sense: No; SMD: Yes; ComponentHeight: 7.87mm; HelpURL: \\cern.ch\dfs\Applications\Altium\Datasheets\XFMR_COILCRAFT_FL2015.pdf; Author: CERN DEM HF; CreateDate: 20.12.2023; LatestRevisionDate: 20.12.2023
L8 = IND_150UH_30%_WURTH_WE-TPC_744066151: Inductor With Core; Part Description: Shielded Tiny Power Inductor (WE-TPC Series); Manufacturer: WURTH ELEKTRONIK; Power: 3A; Resistance: 0.400R; Tolerance: ±30%; Part Number: IND_150UH_30%_WURTH_WE-TPC_744066151; Component Kind: Standard; Component Type: Standard; Pin Count: 2; Value: 150uH; Manufacturer Part Number: 744066151; Mounted: Yes; Socket: No; SMD: Yes; Sense: No; ComponentHeight: 4.1mm; HelpURL: \\cern.ch\dfs\Applications\Altium\Datasheets\IND_WURTH_WE-TPC_744066151.pdf; Author: CERN DEM HF; CreateDate: 20.12.2023; LatestRevisionDate: 20.12.2023
R9 R28 R79 R91 = R0603_3K32_0.1%_0.063W_10PPM: Resistor - 0.1%; Part Description: Thin Film Chip Resistor; Manufacturer: GENERIC; Manufacturer1 Part Number: RN73C1J3K32BTDF; Power: 0.063W; TC: ±10ppm; PressFit: No; Part Number: R0603_3K32_0.1%_0.063W_10PPM; Component Kind: Standard; Component Type: Standard; Pin Count: 2; Value: 3k32; Status: Not Recommended; Manufacturer Part Number: R0603_3K32_0.1%_0.063W_10PPM; Case: 0603; Mounted: Yes; Sense: No; Socket: No; SMD: Yes; Manufacturer1 Example: TYCO HOLSWORTHY; Manufacturer1 ComponentHeight: 0.5mm; HelpURL: \\cern.ch\dfs\Applications\Altium\Datasheets\R0603_Tyco_RN73.pdf; Author: CERN DEM JLC; CreateDate: 03.12.2007; LatestRevisionDate: 13.03.2008
R49 R166 R173-R176 R178-R180 = R0402_10K_1%_0.0625W_100PPM: Resistor - 1%; Part Description: General Purpose Thick Film Chip Resistor; Manufacturer: GENERIC; Manufacturer1 Part Number: 232270671003L; TC: ±100ppm/°C; Part Number: R0402_10K_1%_0.0625W_100PPM; Component Kind: Standard; Component Type: Standard; Pin Count: 2; Value: 10k; Status: Not recommended; Power: 0.0625W; Tolerance: ±1%; Manufacturer Part Number: R0402_10K_1%_0.0625W_100PPM; Case: 0402; Mounted: Yes; Sense: No; Socket: No; SMD: Yes; Manufacturer1 Example: YAGEO PHYCOMP; Manufacturer1 ComponentHeight: 0.4mm; HelpURL: \\cern.ch\dfs\Applications\Altium\Datasheets\R0402_Phycomp_RC0402.pdf; Author: CERN DEM JLC; CreateDate: 2007-12-03; LatestRevisionDate: 2012-10-17
R58 R82 R181 R184 = R0402_13R_1%_0.0625W_100PPM: Resistor - 1%; Part Description: General Purpose Thick Film Chip Resistor; Manufacturer: GENERIC; Manufacturer1 Part Number: 232270671309L; TC: ±100ppm/°C; PressFit: No; Part Number: R0402_13R_1%_0.0625W_100PPM; Component Kind: Standard; Component Type: Standard; Pin Count: 2; Value: 13; Status: Not Recommended; Power: 0.0625W; Manufacturer Part Number: R0402_13R_1%_0.0625W_100PPM; Case: 0402; Mounted: Yes; Sense: No; Socket: No; SMD: Yes; Manufacturer1 Example: YAGEO PHYCOMP; Manufacturer1 ComponentHeight: 0.4mm; HelpURL: \\cern.ch\dfs\Applications\Altium\Datasheets\R0402_Phycomp_RC0402.pdf; Author: CERN DEM JLC; CreateDate: 03.12.2007; LatestRevisionDate: 17.10.2012
R60 R63 R85 R87 = R0603_10K_0.1%_0.063W_10PPM: Resistor - 0.1%; Part Description: Thin Film Chip Resistor; Manufacturer: GENERIC; Manufacturer1 Part Number: RN73C1J10KBTDF; Power: 0.063W; TC: ±10ppm; PressFit: No; Part Number: R0603_10K_0.1%_0.063W_10PPM; Component Kind: Standard; Component Type: Standard; Pin Count: 2; Value: 10k; Status: Not Recommended; Manufacturer Part Number: R0603_10K_0.1%_0.063W_10PPM; Case: 0603; Mounted: Yes; Sense: No; Socket: No; SMD: Yes; Manufacturer1 Example: TYCO HOLSWORTHY; Manufacturer1 ComponentHeight: 0.5mm; HelpURL: \\cern.ch\dfs\Applications\Altium\Datasheets\R0603_Tyco_RN73.pdf; Author: CERN DEM JLC; CreateDate: 03.12.2007; LatestRevisionDate: 13.03.2008
R61 = R0603_30K_0.1%_0.063W_25PPM: Resistor - 0.1%; Part Description: Thin Film Chip Resistor; Manufacturer: GENERIC; Manufacturer1 Part Number: CPF0603B30KE1; Power: 0.063W; TC: ±25ppm; PressFit: No; Part Number: R0603_30K_0.1%_0.063W_25PPM; Component Kind: Standard; Component Type: Standard; Pin Count: 2; Value: 30k; Status: Not Recommended; Manufacturer Part Number: R0603_30K_0.1%_0.063W_25PPM; Case: 0603; Mounted: Yes; Sense: No; Socket: No; SMD: Yes; Manufacturer1 Example: TE CONNECTIVITY; Manufacturer1 ComponentHeight: 0.55mm; HelpURL: \\cern.ch\dfs\Applications\Altium\Datasheets\R0603_TYCO_CPF.pdf; Author: CERN DEM JMW; CreateDate: 28.07.2021; LatestRevisionDate: 28.07.2021
R62 R84 = R0603_100K_1%_0.1W_100PPM: Resistor - 1%; Part Description: General Purpose Thick Film Chip Resistor; Manufacturer: GENERIC; Manufacturer1 Part Number: NRC06F1003TRF; Power: 0.1W; TC: ±100ppm/°C; Part Number: R0603_100K_1%_0.1W_100PPM; Component Kind: Standard; Component Type: Standard; Pin Count: 2; Value: 100k; Status: Preferred; Tolerance: ±1%; Manufacturer Part Number: R0603_100K_1%_0.1W_100PPM; Case: 0603; Mounted: Yes; Sense: No; Socket: No; SMD: Yes; Manufacturer1 Example: NIC COMPONENT; Manufacturer1 ComponentHeight: 0.55mm; HelpURL: \\cern.ch\dfs\Applications\Altium\Datasheets\R0603_NIC_NRC.pdf; Author: CERN DEM JLC; CreateDate: 2007-12-03; LatestRevisionDate: 2008-03-13
R73 = R0603_7K5_1%_0.1W_100PPM: Resistor - 1%; Part Description: General Purpose Thick Film Chip Resistor; Manufacturer: GENERIC; Manufacturer1 Part Number: NRC06F7501TRF; Power: 0.1W; TC: ±100ppm/°C; PressFit: No; Part Number: R0603_7K5_1%_0.1W_100PPM; Component Kind: Standard; Component Type: Standard; Pin Count: 2; Value: 7k5; Status: Preferred; Manufacturer Part Number: R0603_7K5_1%_0.1W_100PPM; Case: 0603; Mounted: Yes; Sense: No; Socket: No; SMD: Yes; Manufacturer1 Example: NIC COMPONENT; Manufacturer1 ComponentHeight: 0.55mm; HelpURL: \\cern.ch\dfs\Applications\Altium\Datasheets\R0603_NIC_NRC.pdf; Author: CERN DEM JLC; CreateDate: 03.12.2007; LatestRevisionDate: 13.03.2008
R74 = R0402_0R_JUMPER: Resistor; Part Description: 1A (0.05R Max DC Resistance) Zero Ohm Jumper; Manufacturer: GENERIC; Manufacturer1 Part Number: 232270591001L; PressFit: No; Part Number: R0402_0R_JUMPER; Component Kind: Standard; Component Type: Standard; Pin Count: 2; Value: 0; Status: Not Recommended; Manufacturer Part Number: R0402_0R_JUMPER; Case: 0402; Mounted: Yes; Sense: No; Socket: No; SMD: Yes; Manufacturer1 Example: YAGEO PHYCOMP; Manufacturer1 ComponentHeight: 0.4mm; HelpURL: \\cern.ch\dfs\Applications\Altium\Datasheets\R0402_Phycomp_RC0402.pdf; Author: CERN DEM JLC; CreateDate: 03.12.2007; LatestRevisionDate: 17.10.2012
R75-R77 R81 = R1210_1M0_0.1%_1W_25ppm_HVCB2010BDE10M0: RES, HV, 2010, 10 Mohm, 0.1%, 25 ppm, 1W; Part Description: Thick Film Chip Resistor; Manufacturer: Stackpole Electronics; TC: ±25ppm/°C; PressFit: No; Part Number: R1210_1M0_0.1%_1W_25ppm_HVCB2010BDE10M0; Component Kind: Standard; Component Type: Standard; Pin Count: 2; Value: 10M; Status: None; Power: 1W; Manufacturer Part Number: HVCB2010BDE10M0; Case: 2010; Mounted: Yes; Sense: No; Socket: No; SMD: Yes; Manufacturer1 ComponentHeight: 0.65mm; HelpURL: \\cern.ch\dfs\Applications\Altium\Datasheets\R2010_WELWYN_LHVC.pdf; Author: GK; CreateDate: 26.02.2015; LatestRevisionDate: 26.02.2015
R78 R80 R90 R93 R94 R177 R182 = R0402_1K_1%_0.0625W_100PPM: Resistor - 1%; Part Description: General Purpose Thick Film Chip Resistor; Manufacturer: GENERIC; Manufacturer1 Part Number: 232270671002L; TC: ±100ppm/°C; Part Number: R0402_1K_1%_0.0625W_100PPM; Component Kind: Standard; Component Type: Standard; Pin Count: 2; Value: 1k; Status: Not recommended; Power: 0.0625W; Tolerance: ±1%; Manufacturer Part Number: R0402_1K_1%_0.0625W_100PPM; Case: 0402; Mounted: Yes; Sense: No; Socket: No; SMD: Yes; Manufacturer1 Example: YAGEO PHYCOMP; Manufacturer1 ComponentHeight: 0.4mm; HelpURL: \\cern.ch\dfs\Applications\Altium\Datasheets\R0402_Phycomp_RC0402.pdf; Author: CERN DEM JLC; CreateDate: 2007-12-03; LatestRevisionDate: 2012-10-17
R83 R92 = R0402_33R_1%_0.0625W_100PPM: Resistor - 1%; Part Description: General Purpose Thick Film Chip Resistor; Manufacturer: GENERIC; Manufacturer1 Part Number: 232270673309L; TC: ±100ppm/°C; PressFit: No; Part Number: R0402_33R_1%_0.0625W_100PPM; Component Kind: Standard; Component Type: Standard; Pin Count: 2; Value: 33; Status: Not Recommended; Power: 0.0625W; Manufacturer Part Number: R0402_33R_1%_0.0625W_100PPM; Case: 0402; Mounted: Yes; Sense: No; Socket: No; SMD: Yes; Manufacturer1 Example: YAGEO PHYCOMP; Manufacturer1 ComponentHeight: 0.4mm; HelpURL: \\cern.ch\dfs\Applications\Altium\Datasheets\R0402_Phycomp_RC0402.pdf; Author: CERN DEM JLC; CreateDate: 03.12.2007; LatestRevisionDate: 17.10.2012
R86 R88 = R0603_13K3_0.1%_0.063W_10PPM: Resistor - 0.1%; Part Description: Thin Film Chip Resistor; Manufacturer: GENERIC; Manufacturer1 Part Number: RN73C1J13K3BTDF; Power: 0.063W; TC: ±10ppm; PressFit: No; Part Number: R0603_13K3_0.1%_0.063W_10PPM; Component Kind: Standard; Component Type: Standard; Pin Count: 2; Value: 13k3; Status: Not Recommended; Manufacturer Part Number: R0603_13K3_0.1%_0.063W_10PPM; Case: 0603; Mounted: Yes; Sense: No; Socket: No; SMD: Yes; Manufacturer1 Example: TYCO HOLSWORTHY; Manufacturer1 ComponentHeight: 0.5mm; HelpURL: \\cern.ch\dfs\Applications\Altium\Datasheets\R0603_Tyco_RN73.pdf; Author: CERN DEM JLC; CreateDate: 03.12.2007; LatestRevisionDate: 13.03.2008
R89 R183 = R0402_100R_1%_0.0625W_100PPM: Resistor - 1%; Part Description: General Purpose Thick Film Chip Resistor; Manufacturer: GENERIC; Manufacturer1 Part Number: 232270671001L; TC: ±100ppm/°C; PressFit: No; Part Number: R0402_100R_1%_0.0625W_100PPM; Component Kind: Standard; Component Type: Standard; Pin Count: 2; Value: 100; Status: Not Recommended; Power: 0.0625W; Tolerance: ±1%; Manufacturer Part Number: R0402_100R_1%_0.0625W_100PPM; Case: 0402; Mounted: Yes; Sense: No; Socket: No; SMD: Yes; Manufacturer1 Example: YAGEO PHYCOMP; Manufacturer1 ComponentHeight: 0.4mm; HelpURL: \\cern.ch\dfs\Applications\Altium\Datasheets\R0402_Phycomp_RC0402.pdf; Author: CERN DEM JLC; CreateDate: 03.12.2007; LatestRevisionDate: 17.10.2012
R163 = R0603_0R33_1%_0.2W_100PPM: Resistor - 1%; Part Description: Thick Film Chip Resistor; Manufacturer: GENERIC; Manufacturer1 Part Number: RCWE0603R330FK; Power: 0.2W; TC: ±100ppm/°C; PressFit: No; Part Number: R0603_0R33_1%_0.2W_100PPM; Component Kind: Standard; Component Type: Standard; Pin Count: 2; Value: 0R33; Status: Not Preferred; Manufacturer Part Number: R0603_0R33_1%_0.2W_100PPM; Case: 0603; Mounted: Yes; Sense: No; Socket: No; SMD: Yes; Manufacturer1 Example: VISHAY DALE; Manufacturer1 ComponentHeight: 0.6mm; HelpURL: \\cern.ch\dfs\Applications\Altium\Datasheets\R0603_VISHAY_RCWE.pdf; Author: CERN DEM BC; CreateDate: 12.10.2020; LatestRevisionDate: 12.10.2020
R164 = R0603_47R_1%_0.1W_100PPM: Resistor - 1%; Part Description: General Purpose Thick Film Chip Resistor; Manufacturer: GENERIC; Manufacturer1 Part Number: NRC06F47R0TRF; Power: 0.1W; TC: ±100ppm/°C; Part Number: R0603_47R_1%_0.1W_100PPM; Component Kind: Standard; Component Type: Standard; Pin Count: 2; Value: 47; Status: Preferred; Tolerance: ±1%; Manufacturer Part Number: R0603_47R_1%_0.1W_100PPM; Case: 0603; Mounted: Yes; Sense: No; Socket: No; SMD: Yes; Manufacturer1 Example: NIC COMPONENT; Manufacturer1 ComponentHeight: 0.55mm; HelpURL: \\cern.ch\dfs\Applications\Altium\Datasheets\R0603_NIC_NRC.pdf; Author: CERN DEM JLC; CreateDate: 2007-12-03; LatestRevisionDate: 2008-03-13
R165 = R0402_33R_1%_0.0625W_100PPM: Resistor - 1%; Part Description: General Purpose Thick Film Chip Resistor; Manufacturer: GENERIC; Manufacturer1 Part Number: 232270673309L; TC: ±100ppm/°C; Part Number: R0402_33R_1%_0.0625W_100PPM; Component Kind: Standard; Component Type: Standard; Pin Count: 2; Value: 33; Status: Not recommended; Power: 0.0625W; Tolerance: ±1%; Manufacturer Part Number: R0402_33R_1%_0.0625W_100PPM; Case: 0402; Mounted: Yes; Sense: No; Socket: No; SMD: Yes; Manufacturer1 Example: YAGEO PHYCOMP; Manufacturer1 ComponentHeight: 0.4mm; HelpURL: \\cern.ch\dfs\Applications\Altium\Datasheets\R0402_Phycomp_RC0402.pdf; Author: CERN DEM JLC; CreateDate: 2007-12-03; LatestRevisionDate: 2012-10-17
R167 R171 = R0402_100R_1%_0.0625W_100PPM: Resistor - 1%; Part Description: General Purpose Thick Film Chip Resistor; Manufacturer: GENERIC; Manufacturer1 Part Number: 232270671001L; TC: ±100ppm/°C; Part Number: R0402_100R_1%_0.0625W_100PPM; Component Kind: Standard; Component Type: Standard; Pin Count: 2; Value: 100; Status: Not recommended; Power: 0.0625W; Tolerance: ±1%; Manufacturer Part Number: R0402_100R_1%_0.0625W_100PPM; Case: 0402; Mounted: Yes; Sense: No; Socket: No; SMD: Yes; Manufacturer1 Example: YAGEO PHYCOMP; Manufacturer1 ComponentHeight: 0.4mm; HelpURL: \\cern.ch\dfs\Applications\Altium\Datasheets\R0402_Phycomp_RC0402.pdf; Author: CERN DEM JLC; CreateDate: 2007-12-03; LatestRevisionDate: 2012-10-17
R168 R169 = R1206_100K_0.1%_0.4W_25PPM_VISHAY_PAT: Resistor - 0.1%; Part Description: Precision Automotive Thin Film Chip Resistors 2kV ESD Rating; Manufacturer: VISHAY DALE THIN FILM; Manufacturer Part Number: PAT1206E1003BS; Power: 0.4W; TC: ±25ppm/°C; PressFit: No; Part Number: R1206_100K_0.1%_0.4W_25PPM_VISHAY_PAT; Component Kind: Standard; Component Type: Standard; Pin Count: 2; Value: 100k; Status: None; Case: 1206; Mounted: Yes; Sense: No; Socket: No; SMD: Yes; ComponentHeight: 0.5mm; HelpURL: \\cern.ch\dfs\Applications\Altium\Datasheets\R1206_VISHAY_PAT.pdf; Author: CERN DEM MR; CreateDate: 19.07.2016; LatestRevisionDate: 19.07.2016
R170 = R2512_100R_1%_1.5W_100PPM_VISHAY_CRCW-HP e3: Resistor - 1%; Part Description: Pulse Proof, High Power Thick Film Chip Resistor; Manufacturer: VISHAY DRALORIC; Manufacturer Part Number: CRCW2512100RFKEHHP; Power: 1.5W; TC: ±100ppm/°C; Voltage: 500V; Part Number: R2512_100R_1%_1.5W_100PPM_VISHAY_CRCW-HP e3; Component Kind: Standard; Component Type: Standard; Pin Count: 2; Value: 100; Status: None; Tolerance: ±1%; Case: 2512; Mounted: Yes; Sense: No; Socket: No; SMD: Yes; ComponentHeight: 0.7mm; HelpURL: \\cern.ch\dfs\Applications\Altium\Datasheets\R2512_VISHAY_CRCW-HP e3.pdf; Author: CERN DEM JLC; CreateDate: 2013-05-21; LatestRevisionDate: 2013-05-21
R172 = R0402_330R_1%_0.0625W_100PPM: Resistor - 1%; Part Description: General Purpose Thick Film Chip Resistor; Manufacturer: GENERIC; Manufacturer1 Part Number: 232270673301L; TC: ±100ppm/°C; Part Number: R0402_330R_1%_0.0625W_100PPM; Component Kind: Standard; Component Type: Standard; Pin Count: 2; Value: 330; Status: Not recommended; Power: 0.0625W; Tolerance: ±1%; Manufacturer Part Number: R0402_330R_1%_0.0625W_100PPM; Case: 0402; Mounted: Yes; Sense: No; Socket: No; SMD: Yes; Manufacturer1 Example: YAGEO PHYCOMP; Manufacturer1 ComponentHeight: 0.4mm; HelpURL: \\cern.ch\dfs\Applications\Altium\Datasheets\R0402_Phycomp_RC0402.pdf; Author: CERN DEM JLC; CreateDate: 2007-12-03; LatestRevisionDate: 2012-10-17
T15 = IRLML6402PBF: P-CHANNEL MOSFET WITH ZENER DIODE; Part Description: -20V -3.7A P-Channel HEXFET® Power MOSFET; Manufacturer: INTERNATIONAL RECTIFIER; PressFit: No; Bonding: No; Part Number: IRLML6402PBF; Component Kind: Standard; Component Type: Standard; Device: IRLML6402PBF; PackageDescription: SOT23, 0.95mm Pitch; 3 Pin, 1.30mm W X 2.92mm L X 1.12mm H body, IPC Medium Density; Manufacturer Part Number: IRLML6402; Pin Count: 3; Case: SOT23-3; Mounted: Yes; Socket: No; SMD: Yes; Sense: No; ComponentHeight: 1.12mm; HelpURL: \\cern.ch\dfs\Applications\Altium\Datasheets\IRLML6402PBF.pdf; Author: CERN DEM JLC; CreateDate: 29.08.2011; LatestRevisionDate: 29.08.2011
T16 T17 = IRLML0060TRPBF: N-CHANNEL MOSFET WITH DIODE; Part Description: 60V 2.7A N-Channel HEXFET® Power MOSFET; Manufacturer: INTERNATIONAL RECTIFIER; PressFit: No; Bonding: No; Part Number: IRLML0060TRPBF; Component Kind: Standard; Component Type: Standard; Device: IRLML0060TRPBF; PackageDescription: SOT23, 0.95mm Pitch; 3 Pin, 1.30mm W X 2.92mm L X 1.12mm H body, IPC Medium Density; Manufacturer Part Number: IRLML0060; Pin Count: 3; Case: SOT23-3; Mounted: Yes; Socket: No; SMD: Yes; Sense: No; ComponentHeight: 1.12mm; HelpURL: \\cern.ch\dfs\Applications\Altium\Datasheets\IRLML0060TRPBF.pdf; Author: CERN DEM JLC; CreateDate: 06.10.2011; LatestRevisionDate: 06.10.2011